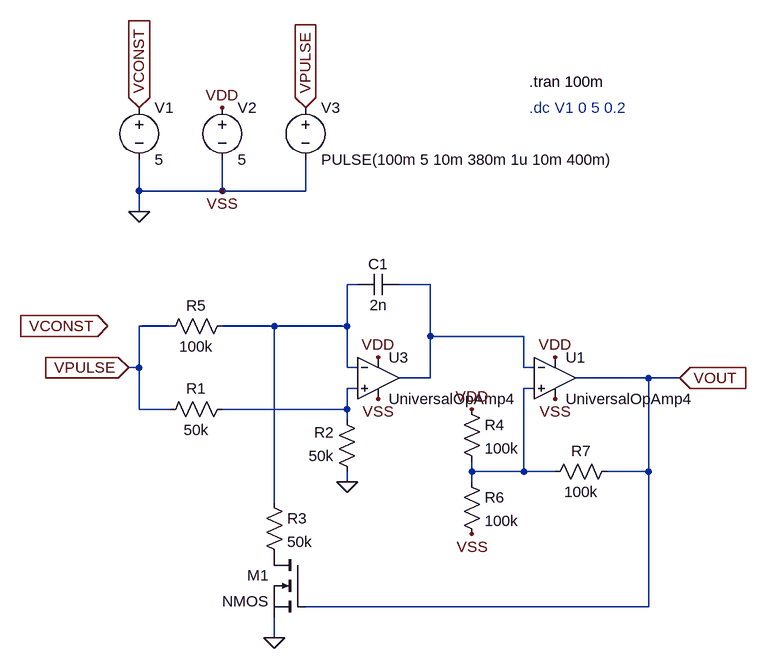
[diagram p0: schematic vco2.asc]
vco2.asc, the LTspice schematic file:
Version 4
SHEET 1 1580 1412
WIRE -128 384 -128 336
WIRE 0 384 0 336
WIRE 0 384 -128 384
WIRE 128 384 128 336
WIRE 128 384 0 384
WIRE -128 416 -128 384
WIRE 208 528 192 528
WIRE 320 528 272 528
WIRE -80 592 -128 592
WIRE 80 592 0 592
WIRE 192 592 192 528
WIRE 192 592 80 592
WIRE 320 608 320 528
WIRE 464 608 320 608
WIRE -128 656 -128 592
WIRE -128 656 -144 656
WIRE 192 656 192 592
WIRE 208 656 192 656
WIRE 464 656 464 608
WIRE 480 656 464 656
WIRE 320 672 320 608
WIRE 320 672 272 672
WIRE 656 672 544 672
WIRE 704 672 656 672
WIRE 208 688 192 688
WIRE 480 688 464 688
WIRE -128 720 -128 656
WIRE -80 720 -128 720
WIRE 192 720 192 688
WIRE 192 720 0 720
WIRE 192 736 192 720
WIRE 384 816 384 800
WIRE 464 816 464 688
WIRE 464 816 384 816
WIRE 512 816 464 816
WIRE 656 816 656 672
WIRE 656 816 592 816
WIRE 192 832 192 816
WIRE 384 832 384 816
WIRE 80 864 80 592
WIRE 656 1024 656 816
WIRE 656 1024 128 1024
WIRE 80 1072 80 1040
FLAG 0 256 VDD
FLAG 0 384 VSS
FLAG -128 416 0
FLAG -128 256 VCONST
IOPIN -128 256 In
FLAG 128 256 VPULSE
IOPIN 128 256 In
FLAG 240 704 VSS
FLAG 240 640 VDD
FLAG 192 832 0
FLAG 80 1072 0
FLAG 512 704 VSS
FLAG 512 640 VDD
FLAG 384 720 VDD
FLAG 384 912 VSS
FLAG 704 672 VOUT
IOPIN 704 672 In
FLAG -144 656 VPULSE
IOPIN -144 656 In
FLAG -176 592 VCONST
IOPIN -176 592 In
SYMBOL voltage -128 240 R0
WINDOW 123 0 0 Left 0
WINDOW 39 0 0 Left 0
SYMATTR InstName V1
SYMATTR Value 5
SYMBOL voltage 0 240 R0
WINDOW 123 0 0 Left 0
WINDOW 39 0 0 Left 0
SYMATTR InstName V2
SYMATTR Value 5
SYMBOL voltage 128 240 R0
WINDOW 123 0 0 Left 0
WINDOW 39 0 0 Left 0
SYMATTR InstName V3
SYMATTR Value PULSE(100m 5 10m 380m 1u 10m 400m)
SYMBOL OpAmps\\UniversalOpAmp4 240 672 R0
SYMATTR InstName U3
SYMBOL res 16 576 R90
WINDOW 0 0 56 VBottom 2
WINDOW 3 32 56 VTop 2
SYMATTR InstName R5
SYMATTR Value 100k
SYMBOL cap 272 512 R90
WINDOW 0 0 32 VBottom 2
WINDOW 3 32 32 VTop 2
SYMATTR InstName C1
SYMATTR Value 2n
SYMBOL res 16 704 R90
WINDOW 0 0 56 VBottom 2
WINDOW 3 32 56 VTop 2
SYMATTR InstName R1
SYMATTR Value 50k
SYMBOL res 208 832 R180
WINDOW 0 36 76 Left 2
WINDOW 3 36 40 Left 2
SYMATTR InstName R2
SYMATTR Value 50k
SYMBOL nmos 128 944 M0
SYMATTR InstName M1
SYMBOL res 64 848 R0
SYMATTR InstName R3
SYMATTR Value 50k
SYMBOL OpAmps\\UniversalOpAmp4 512 672 R0
SYMATTR InstName U1
SYMBOL res 368 704 R0
SYMATTR InstName R4
SYMATTR Value 100k
SYMBOL res 368 816 R0
SYMATTR InstName R6
SYMATTR Value 100k
SYMBOL res 608 800 R90
WINDOW 0 0 56 VBottom 2
WINDOW 3 32 56 VTop 2
SYMATTR InstName R7
SYMATTR Value 100k
TEXT 472 216 Left 2 !.tran 100m
TEXT 472 256 Left 2 ;.dc V1 0 5 0.2

The netlist it stands for:
* vco2.asc
V1 VCONST 0 5
V2 VDD 0 5
V3 VPULSE 0 PULSE(100m 5 10m 380m 1u 10m 400m)
* U3: UniversalOpAmp4 (symbol OpAmps\UniversalOpAmp4 not available, pins judged from their places): In+=N003 In-=N001 V+=VDD V-=0 OUT=N002
R5 N001 VPULSE 100k
C1 N002 N001 2n
R1 N003 VPULSE 50k
R2 0 N003 50k
M1 P001 VOUT 0 0 NMOS
R3 N001 P001 50k
* U1: UniversalOpAmp4 (symbol OpAmps\UniversalOpAmp4 not available, pins judged from their places): In+=N004 In-=N002 V+=VDD V-=0 OUT=VOUT
R4 VDD N004 100k
R6 N004 0 100k
R7 VOUT N004 100k
.model NMOS NMOS
.model PMOS PMOS
.lib standard.mos
.tran 100m
* .dc V1 0 5 0.2
.backanno
.end